# EAGLE design Fartreg 72V (EAGLE 5.03)
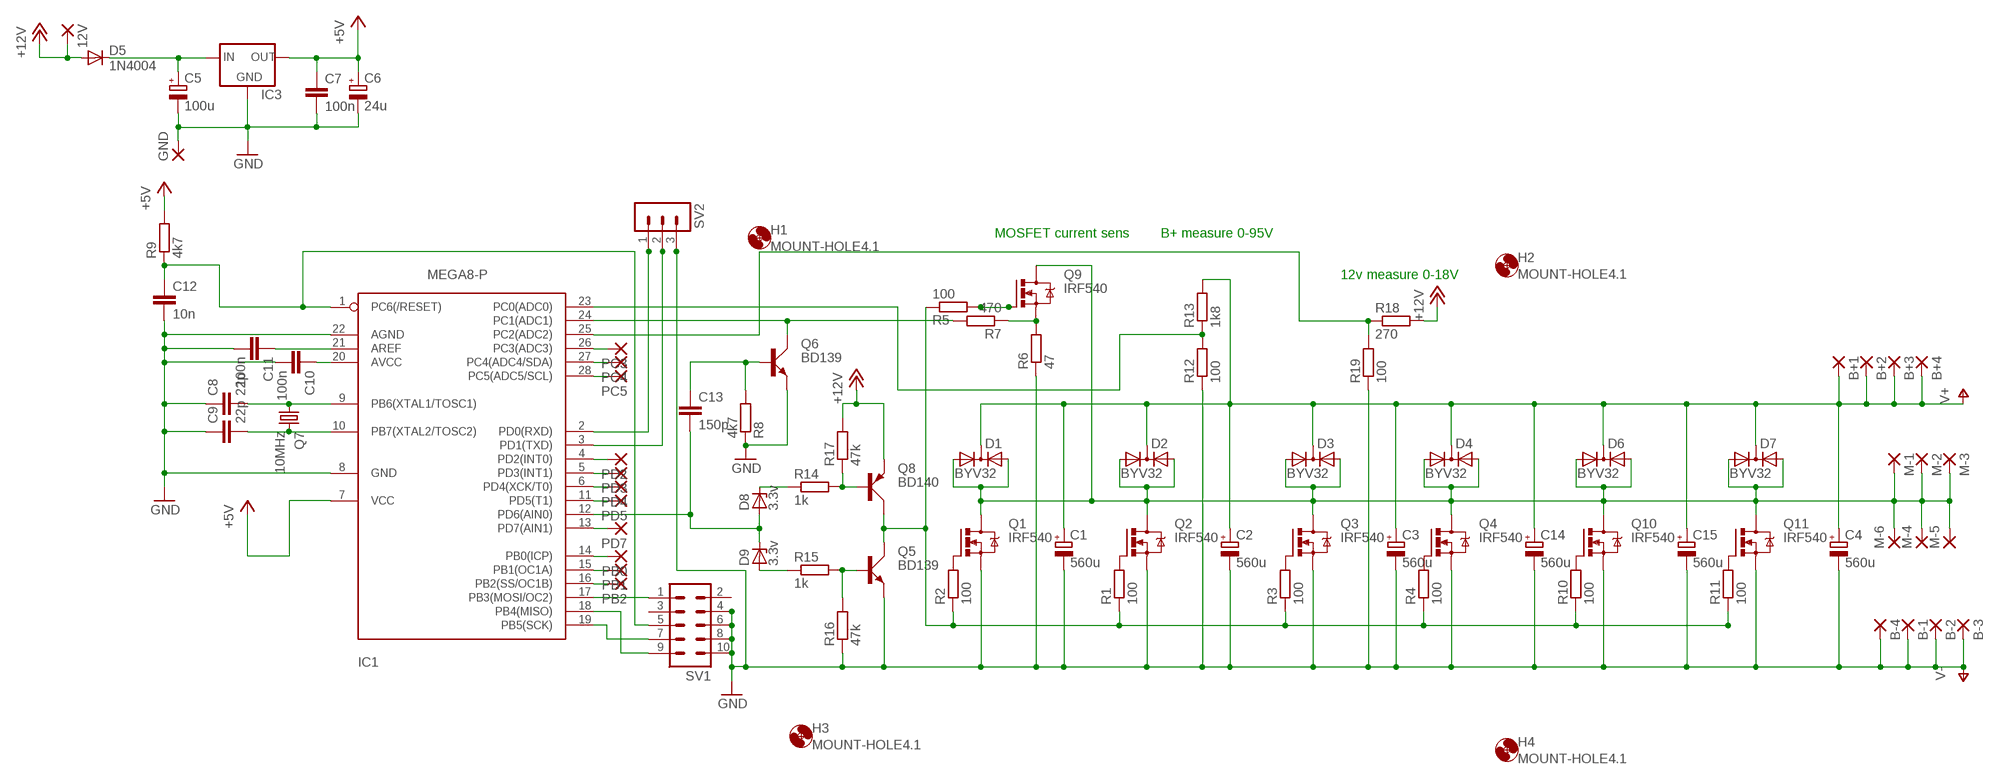
[diagram p0: schematic, sheet 1]

## Parts
12V  3,81/1,4  [3,81/1,4]
B+1  3,81/1,4  [3,81/1,4]
B+2  3,81/1,4  [3,81/1,4]
B+3  3,81/1,4  [3,81/1,4]
B+4  3,81/1,4  [3,81/1,4]
B-1  3,81/1,4  [3,81/1,4]
B-2  3,81/1,4  [3,81/1,4]
B-3  3,81/1,4  [3,81/1,4]
B-4  3,81/1,4  [3,81/1,4]
C1  560u  CPOL-EUE10-22.5  [EB22,5D]
C2  560u  CPOL-EUE10-22.5  [EB22,5D]
C3  560u  CPOL-EUE10-22.5  [EB22,5D]
C4  560u  CPOL-EUE10-22.5  [EB22,5D]
C5  100u  CPOL-EUE2.5-5  [E2,5-5]
C6  24u  CPOL-EUE2.5-5  [E2,5-5]
C7  100n  C-EU025_050-045X075  [C025_050-045X075]
C8  22p  C-EU025_050-045X075  [C025_050-045X075]
C9  22p  C-EU025_050-045X075  [C025_050-045X075]
C10  100n  C-EU025_050-045X075  [C025_050-045X075]
C11  100n  C-EU025_050-045X075  [C025_050-045X075]
C12  10n  C-EU025_050-045X075  [C025_050-045X075]
C13  150p  C-EU025_050-045X075  [C025_050-045X075]
C14  560u  CPOL-EUE10-22.5  [EB22,5D]
C15  560u  CPOL-EUE10-22.5  [EB22,5D]
D1  BYV32  [TO220ABS]
D2  BYV32  [TO220ABS]
D3  BYV32  [TO220ABS]
D4  BYV32  [TO220ABS]
D5  1N4004  [DO41-10]
D6  BYV32  [TO220ABS]
D7  BYV32  [TO220ABS]
D8  3.3v  BZX55  [DO35Z10]
D9  3.3v  BZX55  [DO35Z10]
GND  3,81/1,4  [3,81/1,4]
H1  MOUNT-HOLE4.1  [4,1]
H2  MOUNT-HOLE4.1  [4,1]
H3  MOUNT-HOLE4.1  [4,1]
H4  MOUNT-HOLE4.1  [4,1]
IC1  MEGA8-P  [DIL28-3]
IC3  78XXS  [78XXS]
M-1  3,81/1,4  [3,81/1,4]
M-2  3,81/1,4  [3,81/1,4]
M-3  3,81/1,4  [3,81/1,4]
M-4  3,81/1,4  [3,81/1,4]
M-5  3,81/1,4  [3,81/1,4]
M-6  3,81/1,4  [3,81/1,4]
PB0  1,6/0,9  [1,6/0,9]
PB1  1,6/0,9  [1,6/0,9]
PB2  1,6/0,9  [1,6/0,9]
PC3  1,6/0,9  [1,6/0,9]
PC4  1,6/0,9  [1,6/0,9]
PC5  1,6/0,9  [1,6/0,9]
PD2  1,6/0,9  [1,6/0,9]
PD3  1,6/0,9  [1,6/0,9]
PD4  1,6/0,9  [1,6/0,9]
PD5  1,6/0,9  [1,6/0,9]
PD7  1,6/0,9  [1,6/0,9]
Q1  IRF540  [TO220BV]
Q2  IRF540  [TO220BV]
Q3  IRF540  [TO220BV]
Q4  IRF540  [TO220BV]
Q5  BD139  [TO126AV]
Q6  BD139  [TO126AV]
Q7  10MHz  CRYSTALHC49S  [HC49/S]
Q8  BD140  [TO126AV]
Q9  IRF540  [TO220BV]
Q10  IRF540  [TO220BV]
Q11  IRF540  [TO220BV]
R1  100  R-EU_0207/10  [0207/10]
R2  100  R-EU_0207/10  [0207/10]
R3  100  R-EU_0207/10  [0207/10]
R4  100  R-EU_0207/10  [0207/10]
R5  100  R-EU_0207/10  [0207/10]
R6  47  R-EU_0207/10  [0207/10]
R7  470  R-EU_0207/10  [0207/10]
R8  4k7  R-EU_0207/10  [0207/10]
R9  4k7  R-EU_0207/10  [0207/10]
R10  100  R-EU_0207/10  [0207/10]
R11  100  R-EU_0207/10  [0207/10]
R12  100  R-EU_0207/10  [0207/10]
R13  1k8  R-EU_0207/10  [0207/10]
R14  1k  R-EU_0207/10  [0207/10]
R15  1k  R-EU_0207/10  [0207/10]
R16  47k  R-EU_0207/10  [0207/10]
R17  47k  R-EU_0207/10  [0207/10]
R18  270  R-EU_0207/10  [0207/10]
R19  100  R-EU_0207/10  [0207/10]
SV1  MA05-2  [MA05-2]
SV2  MA03-1  [MA03-1]

## Nets
+5V: C6.+ C7.1 IC1.7(VCC) IC3.OUT R9.2
+12V: 12V.1(P) D5.A Q8.E R17.2 R18.2
GND: B-1.1(P) B-2.1(P) B-3.1(P) B-4.1(P) C1.- C2.- C3.- C4.- C5.- C6.- C7.2 C8.1 C9.1 C10.2 C11.2 C12.2 C14.- C15.- GND.1(P) IC1.8(GND) IC1.22(AGND) IC3.GND Q1.S Q2.S Q3.S Q4.S Q5.E Q6.E Q10.S Q11.S R6.1 R8.1 R12.1 R16.1 R19.1 SV1.4 SV1.6 SV1.8 SV1.10 SV2.3 ; supply symbol labelled V-
N$1: Q10.G R10.2
N$2: IC1.24(PC1(ADC1)) Q6.C R7.2
N$3: Q9.S R6.2 R7.1
N$4: C13.1 Q6.B R8.2
N$5: C10.1 IC1.20(AVCC)
N$6: C11.1 IC1.21(AREF)
N$7: Q2.G R1.2
N$8: Q1.G R2.2
N$9: Q3.G R3.2
N$10: Q4.G R4.2
N$11: IC1.28(PC5(ADC5/SCL)) PC5.1(P)
N$12: C8.2 IC1.9(PB6(XTAL1/TOSC1)) Q7.1
N$13: Q5.C Q8.C R1.1 R2.1 R3.1 R4.1 R5.1 R10.1 R11.1
N$14: C9.2 IC1.10(PB7(XTAL2/TOSC2)) Q7.2
N$15: Q9.G R5.2
N$16: IC1.2(PD0(RXD)) SV2.1
N$17: C5.+ D5.C IC3.IN
N$18: Q11.G R11.2
N$19: IC1.3(PD1(TXD)) SV2.2
N$20: IC1.17(PB3(MOSI/OC2)) SV1.1
N$21: IC1.19(PB5(SCK)) SV1.7
N$22: IC1.18(PB4(MISO)) SV1.9
N$23: D1.A1 D1.A2 D2.A1 D2.A2 D3.A1 D3.A2 D4.A1 D4.A2 D6.A1 D6.A2 D7.A1 D7.A2 M-1.1(P) M-2.1(P) M-3.1(P) M-4.1(P) M-5.1(P) M-6.1(P) Q1.D Q2.D Q3.D Q4.D Q9.D Q10.D Q11.D
N$24: C13.2 D8.A D9.C IC1.12(PD6(AIN0))
N$25: C12.1 IC1.1(PC6(/RESET)) R9.1 SV1.5
N$26: IC1.23(PC0(ADC0)) R12.2 R13.1
N$27: Q8.B R14.2 R17.1
N$28: D9.A R15.1
N$29: D8.C R14.1
N$30: Q5.B R15.2 R16.2
N$31: IC1.25(PC2(ADC2)) R18.1 R19.2
N$32: IC1.11(PD5(T1)) PD5.1(P)
N$33: IC1.26(PC3(ADC3)) PC3.1(P)
N$34: IC1.27(PC4(ADC4/SDA)) PC4.1(P)
N$36: IC1.4(PD2(INT0)) PD2.1(P)
N$37: IC1.5(PD3(INT1)) PD3.1(P)
N$38: IC1.6(PD4(XCK/T0)) PD4.1(P)
N$40: IC1.13(PD7(AIN1)) PD7.1(P)
N$41: IC1.14(PB0(ICP)) PB0.1(P)
N$42: IC1.15(PB1(OC1A)) PB1.1(P)
N$43: IC1.16(PB2(SS/OC1B)) PB2.1(P)
V+: B+1.1(P) B+2.1(P) B+3.1(P) B+4.1(P) C1.+ C2.+ C3.+ C4.+ C14.+ C15.+ D1.C D2.C D3.C D4.C D6.C D7.C R13.2
Unconnected: SV1.2 SV1.3

## Notes on the sheet
- MOSFET current sens | B+ measure 0-95V
- 12v measure 0-18V

## Library data of the parts
12V B+1-B+4 B-1-B-4 GND M-1-M-6 = wirepad:3,81/1,4: THROUGH-HOLE PAD
C1-C6 C14 C15 = rcl:CPOL-EU: POLARIZED CAPACITOR, European symbol
C7-C13 = rcl:C-EU: CAPACITOR, European symbol
D1-D4 D6 D7 = diode:BYV32: DIODE 2 x Si diode 200 V, 20 A/230 Apeak, 25 ns
D5 = diode:1N4004: DIODE general purpose rectifier, 1 A
D8 D9 = diode:BZX55: Z DIODE
H1-H4 = holes:MOUNT-HOLE: MOUNTING HOLE with drill center marker
IC1 = atmel:MEGA8-P: MICROCONTROLLER 8 Kbytes FLASH 1 kbytes SRAM 512 bytes EEPROM USART 4-channel 10 bit ADC 2-channel 8 bit ADC Source: avr.lbr
IC3 = v-reg:78XXS: VOLTAGE REGULATOR
PB0 PB1 PB2 PC3-PC5 PD2-PD5 PD7 = wirepad:1,6/0,9: THROUGH-HOLE PAD
Q1-Q4 Q9-Q11 = transistor-power:IRF540: HEXFET Power MOSFET
Q5 Q6 = transistor-power:BD139: NPN TRANSISTOR
Q7 = crystal:CRYSTAL: CRYSTAL
Q8 = transistor-power:BD140: PNP TRANSISTOR
R1-R19 = rcl:R-EU_: RESISTOR, European symbol
SV1 = con-lstb:MA05-2: PIN HEADER
SV2 = con-lstb:MA03-1: PIN HEADER

## Board
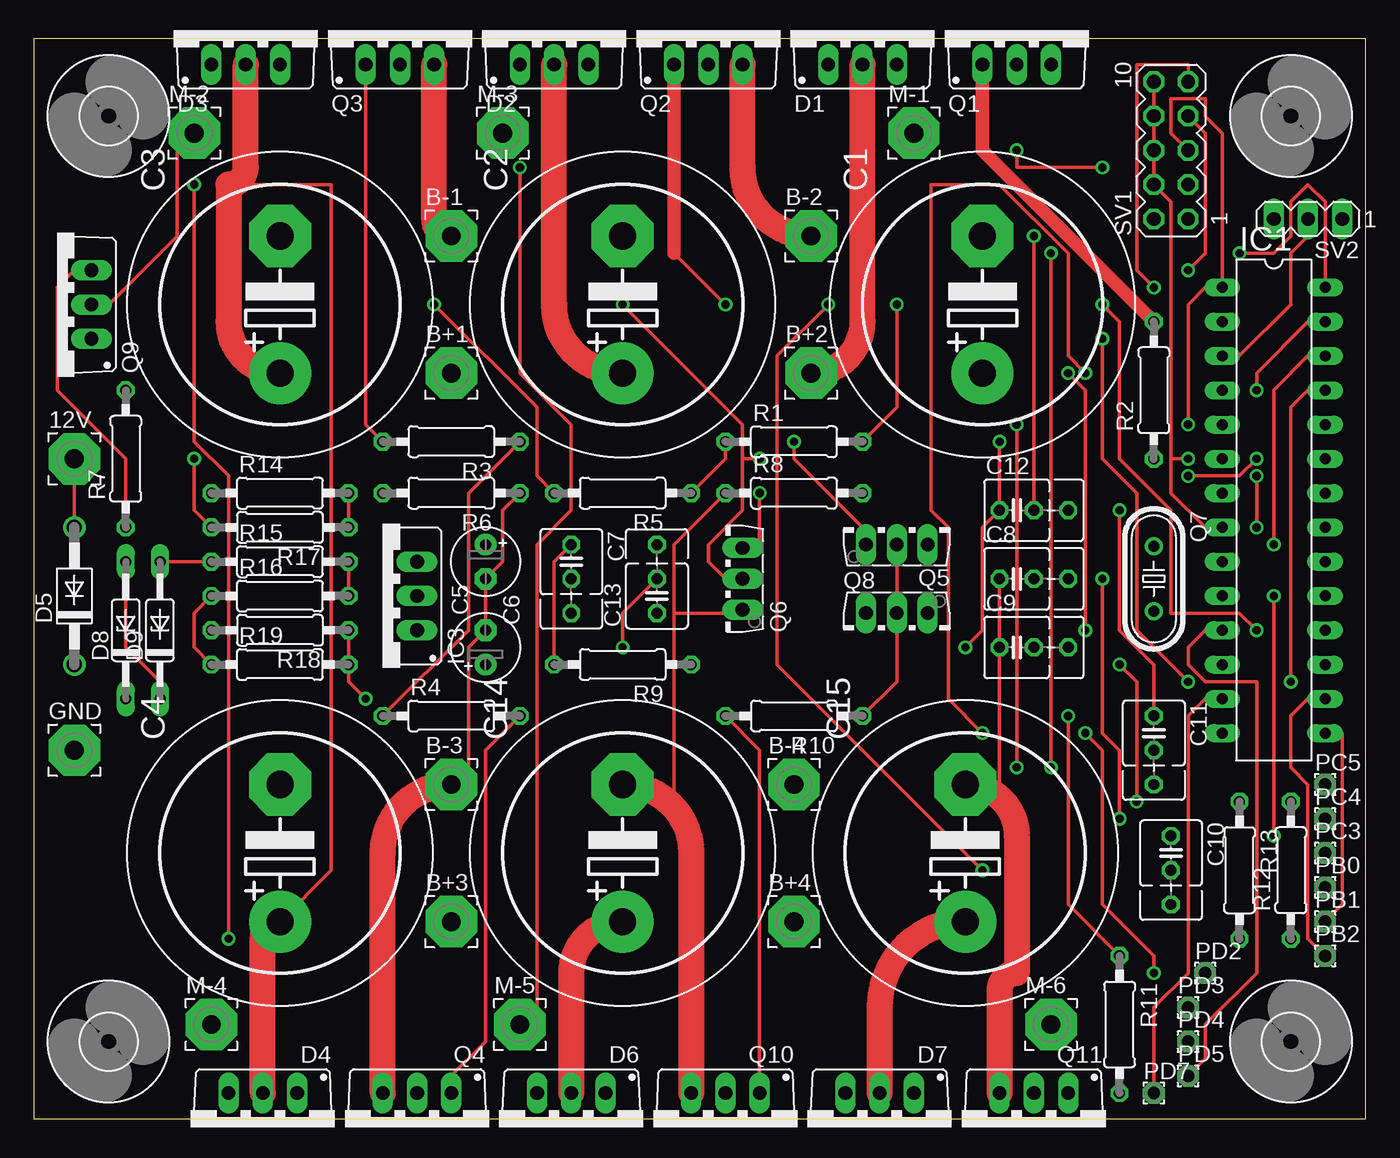
[diagram p1: board, top side]
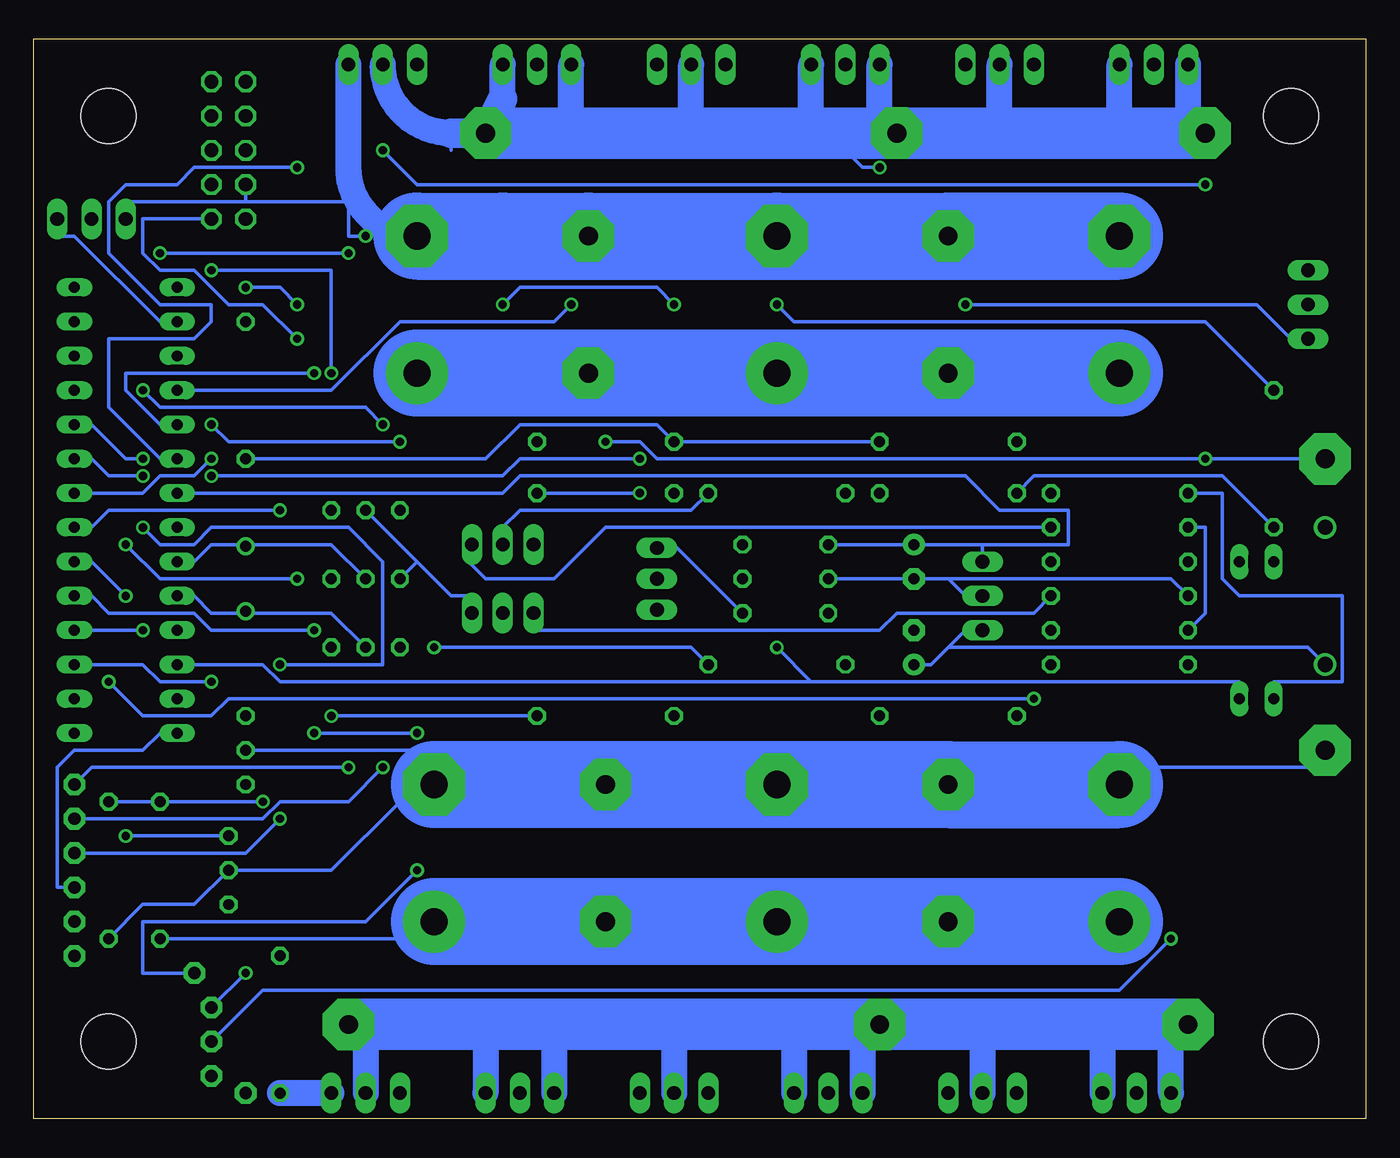
[diagram p2: board, bottom side, seen from below]

Size 98.73 x 80 mm. Coordinates in mm from the lower left corner, seen from the top.
Outline: 0,0 98.73,0 98.73,80 0,80 0,0
Copper layers (1*16): Top 0.035mm / dielectric 1.5mm / Bottom 0.035mm
Design rules "default": minimum track width 10mil, minimum drill 24mil, track to track 8mil, track to pad 8mil, pad to pad 8mil, via to via 8mil, smd to smd 8mil, copper to edge 40mil, drill to drill 8mil, minimum pad ring 10mil, minimum via ring 8mil, stop-mask expansion 4mil, vias tented up to drill 0mil, thermal gap 10mil

### Footprints (pad centres in the part's own frame; a part is rotated, then mirrored left to right if it is on the bottom)
3,81/1,4 = drill 1.397 pad 3.81 octagon: 1 0,0
EB22,5D = drill 2.007 pad 4.597 round: + -5.08,0 | drill 2.007 pad 4.597 octagon: - 5.08,0
E2,5-5 = drill 0.813 pad 1.6 round: + -1.27,0 | drill 0.813 pad 1.6 octagon: - 1.27,0
C025_050-045X075 = drill 0.813 octagon: 1 -1.27,0; 2 1.27,0; 3 3.81,0
TO220ABS = drill 1.016 long: A1 -2.54,-2.54; A2 2.54,-2.54; C 0,-2.54
DO41-10 = drill 1.118 round: A 5.08,0; C -5.08,0
DO35Z10 = drill 0.813 long: A 5.08,0; C -5.08,0
4,1 = hole 4.1: 0,0
DIL28-3 = drill 0.813 long: 1 -16.51,-3.81; 2 -13.97,-3.81; 3 -11.43,-3.81; 4 -8.89,-3.81; 5 -6.35,-3.81; 6 -3.81,-3.81; 7 -1.27,-3.81; 8 1.27,-3.81; 9 3.81,-3.81; 10 6.35,-3.81; 11 8.89,-3.81; 12 11.43,-3.81; 13 13.97,-3.81; 14 16.51,-3.81; 15 16.51,3.81; 16 13.97,3.81; 17 11.43,3.81; 18 8.89,3.81; 19 6.35,3.81; 20 3.81,3.81; 21 1.27,3.81; 22 -1.27,3.81; 23 -3.81,3.81; 24 -6.35,3.81; 25 -8.89,3.81; 26 -11.43,3.81; 27 -13.97,3.81; 28 -16.51,3.81
78XXS = drill 1.016 long: GND 0,-2.54; IN -2.54,-2.54; OUT 2.54,-2.54
1,6/0,9 = drill 0.914 pad 1.6 octagon: 1 0,0
TO220BV = drill 1.016 long: D 0,-2.54; G -2.54,-2.54; S 2.54,-2.54
TO126AV = drill 1.016 long: B 2.286,-1.27; C 0,-1.27; E -2.286,-1.27
HC49/S = drill 0.813 round: 1 -2.413,0; 2 2.413,0
0207/10 = drill 0.813 octagon: 1 -5.08,0; 2 5.08,0
MA05-2 = drill 1.016 octagon: 1 -5.08,-1.27; 2 -5.08,1.27; 3 -2.54,-1.27; 4 -2.54,1.27; 5 0,-1.27; 6 0,1.27; 7 2.54,-1.27; 8 2.54,1.27; 9 5.08,-1.27; 10 5.08,1.27
MA03-1 = drill 1.016 long: 1 -2.54,0; 2 0,0; 3 2.54,0

### Placement (x,y rotation side)
12V  3.01,48.89 0 top
B+1  30.95,55.24 0 top
B+2  57.62,55.24 0 top
B+3  30.95,14.6 0 top
B+4  56.35,14.6 0 top
B-1  30.95,65.4 0 top
B-2  57.62,65.4 0 top
B-3  30.95,24.76 0 top
B-4  56.35,24.76 0 top
C1  70.32,60.32 90 top
C2  43.65,60.32 90 top
C3  18.25,60.32 90 top
C4  18.25,19.68 90 top
C5  33.49,34.92 90 top
C6  33.49,41.27 270 top
C7  39.84,41.27 270 top
C8  72.86,40 0 top
C9  72.86,34.92 0 top
C10  84.29,19.68 270 top
C11  83.02,28.57 270 top
C12  72.86,45.08 0 top
C13  46.19,38.73 90 top
C14  43.65,19.68 90 top
C15  69.05,19.68 90 top
D1  61.43,80.64 0 top
D2  38.57,80.64 0 top
D3  15.71,80.64 0 top
D4  16.98,-0.64 180 top
D5  3.01,38.73 90 top
D6  39.84,-0.64 180 top
D7  62.7,-0.64 180 top
D8  6.82,36.19 90 top
D9  9.36,36.19 90 top
GND  3.01,27.3 0 top
H1  5.55,5.71 0 top
H2  5.55,74.29 0 top
H3  93.18,74.29 0 top
H4  93.18,5.71 0 top
IC1  91.91,45.08 270 top
IC3  25.87,38.73 90 top
M-1  65.24,73.02 0 top
M-2  11.9,73.02 0 top
M-3  34.76,73.02 0 top
M-4  13.17,6.98 0 top
M-5  36.03,6.98 0 top
M-6  75.4,6.98 0 top
PB0  95.72,17.14 0 top
PB1  95.72,14.6 0 top
PB2  95.72,12.06 0 top
PC3  95.72,19.68 0 top
PC4  95.72,22.22 0 top
PC5  95.72,24.76 0 top
PD2  86.83,10.79 0 top
PD3  85.56,8.25 0 top
PD4  85.56,5.71 0 top
PD5  85.56,3.17 0 top
PD7  83.02,1.9 0 top
Q1  72.86,80.64 0 top
Q2  50,80.64 0 top
Q3  27.14,80.64 0 top
Q4  28.41,-0.64 180 top
Q5  63.97,36.19 180 top
Q6  51.27,40 90 top
Q7  83.02,40 270 top
Q8  63.97,43.81 0 top
Q9  1.74,60.32 90 top
Q10  51.27,-0.64 180 top
Q11  74.13,-0.64 180 top
R1  56.35,50.16 0 top
R2  83.02,53.97 90 top
R3  30.95,50.16 180 top
R4  30.95,29.84 0 top
R5  43.65,46.35 180 top
R6  30.95,46.35 180 top
R7  6.82,48.89 90 top
R8  56.35,46.35 0 top
R9  43.65,33.65 180 top
R10  56.35,29.84 180 top
R11  80.48,6.98 270 top
R12  93.18,18.41 90 top
R13  89.37,18.41 270 top
R14  18.25,46.35 0 top
R15  18.25,41.27 0 top
R16  18.25,38.73 0 top
R17  18.25,43.81 180 top
R18  18.25,36.19 180 top
R19  18.25,33.65 0 top
SV1  84.29,71.75 90 top
SV2  94.45,66.67 180 top

### Tracks (layer width: path | path; a pad name or v marks a point on that pad's centre or on a via)
+5V
  Top 0.254: R9.2 38.57,41.27 C7.1
  Bottom 0.254: 28.41,42.54 C6.+ C7.1 | 28.41,42.54 22.06,42.54 22.06,45.08 27.14,45.08 29.68,47.62 62.7,47.62 63.97,46.35 IC1.7 | 28.41,42.54 IC3.OUT
+12V  (via drill 0.61)
  Top 0.254: v56.35,50.16 56.35,48.89 61.43,43.81 Q8.E | D5.A 12V.1 | R17.2 11.9,45.08 v11.9,48.89
  Bottom 0.254: R18.2 11.9,37.46 11.9,43.81 R17.2 | v56.35,50.16 53.81,50.16 52.54,48.89 v11.9,48.89 12V.1
GND  (via drill 0.61)
  Top 0.254: C15.- 67.78,26.03 | SV1.10 SV1.8 SV1.6 SV1.4 84.29,67.94 84.29,48.89 | 84.29,48.89 84.29,46.35 86.83,43.81 IC1.8 | 84.29,48.89 v85.56,48.89 | R19.1 11.9,34.92 11.9,37.46 R16.1 | R6.1 34.76,45.08 34.76,41.27 C6.- C5.- 32.22,34.92 32.22,26.03 B-3.1 | C8.1 C9.1 71.59,24.76 71.16,24.12 | R8.1 47.46,42.54 47.46,37.46 | 47.46,37.46 47.46,23.49 47.24,23.27 | 47.46,37.46 51.27,37.46 Q6.E | C12.2 v74.13,65.4
  Top 1.93: Q3.S 29.68,66.67 arc90 B-1.1 | Q2.S 52.54,70.48 arc90 B-2.1 | Q10.S 48.73,19.68 arc45 47.24,23.27 arc45 C14.- | Q11.S 71.59,9.52 arc-90 72.86,10.79 72.86,20.95 arc56 71.16,24.12 arc34 C15.- | Q4.S 25.87,19.68 arc-90 B-3.1
  Bottom 0.254: C15.- 71.59,26.03 | 63.97,65.4 63.97,62.86 | C4.- 15.71,26.03 4.28,26.03 GND.1 | 75.4,67.94 83.02,67.94 | 83.02,67.94 91.91,67.94 SV2.3 | v85.56,48.89 86.83,47.62 89.37,47.62 90.64,46.35 IC1.22 | 83.02,67.94 SV1.4 | C7.2 C6.- 30.95,40 | 30.95,40 29.68,38.73 IC3.GND | R16.1 14.44,40 30.95,40 | 70.32,41.27 67.78,38.73 66.51,38.73 Q5.E | 70.32,41.27 C12.2 | C8.1 70.32,41.27 | R12.1 90.64,15.87 86.83,15.87 C10.2 76.67,18.41 71.59,23.49 C15.- | C11.2 70.32,27.3 C15.- | 75.4,67.94 75.4,65.4 v74.13,65.4 | 75.4,67.94 74.86,68.21
  Bottom 1.93: Q1.S 75.4,70.48 arc-27 74.86,68.21 arc-63 C1.-
  Bottom 6.452: B-1.1 C3.- C2.- B-2.1 63.97,65.4 C1.- | C4.- B-3.1 C14.- B-4.1 C15.-
N$1
  Top 0.254: R10.2 53.81,27.3 Q10.G
N$2  (via drill 0.61)
  Top 0.254: v43.65,60.32 52.54,51.43 52.54,48.89 | 52.54,48.89 52.54,45.08 50,42.54 50,41.27 51.27,40 Q6.C | v90.64,48.89 89.37,47.62 v85.56,47.62 | 52.54,48.89 v53.81,48.89
  Bottom 0.254: R7.2 11.9,59.05 42.38,59.05 v43.65,60.32 | v90.64,48.89 91.91,48.89 94.45,51.43 IC1.24 | v85.56,47.62 63.97,47.62 62.7,48.89 v53.81,48.89
N$3
  Top 0.254: R7.1 6.82,48.89 1.74,53.97 1.74,61.59 3.01,62.86 Q9.S
  Bottom 0.254: R7.1 10.63,47.62 24.6,47.62 R6.2
N$4  (via drill 0.61)
  Top 0.254: v53.81,46.35 53.81,42.54 Q6.B
  Bottom 0.254: C13.1 51.27,42.54 Q6.B | v53.81,46.35 R8.2
N$5  (via drill 0.61)
  Top 0.254: v91.91,20.95 v91.91,38.73
  Bottom 0.254: C10.1 v91.91,20.95 | v91.91,38.73 94.45,41.27 IC1.20
N$6  (via drill 0.61)
  Top 0.254: C11.1 83.02,33.65 80.48,36.19 v80.48,45.08
  Bottom 0.254: v80.48,45.08 93.18,45.08 94.45,43.81 IC1.21
N$7  (via drill 0.61)
  Top 0.254: R1.2 63.97,52.7 v63.97,60.32 | v51.27,60.32 47.46,64.13
  Top 1.016: 47.46,64.13 Q2.G
  Bottom 0.254: v63.97,60.32 62.7,61.59 52.54,61.59 v51.27,60.32
N$8
  Top 1.016: Q1.G 70.32,71.75 R2.2
N$9
  Top 0.254: R3.2 24.6,51.43 Q3.G
N$10
  Top 0.254: R4.2 33.49,27.3 33.49,5.71 30.95,3.17 Q4.G
N$11  (via drill 0.61)
  Top 0.254: IC1.28 95.72,67.94 94.45,69.21 93.18,67.94 93.18,65.4 91.91,64.13 v89.37,64.13 | v75.4,26.03 v75.4,64.13
  Bottom 0.254: v75.4,64.13 v89.37,64.13 | v75.4,26.03 94.45,26.03 PC5.1
N$12
  Bottom 0.254: C8.2 76.67,42.54 83.02,42.54 | 83.02,42.54 85.56,42.54 86.83,41.27 IC1.9 | 83.02,42.54 Q7.1
N$13  (via drill 0.61)
  Top 0.254: R10.1 63.97,32.38 Q5.C Q8.C | R11.1 76.67,15.87 v76.67,29.84 | R4.1 32.22,36.19 32.22,46.35 R3.1 | R5.1 51.27,48.89 R1.1
  Bottom 0.254: R10.1 v76.67,29.84 | R2.1 65.24,48.89 62.7,51.43 52.54,51.43 R1.1 R3.1 | R5.1 50,45.08 62.7,45.08 63.97,43.81 Q8.C
N$14
  Bottom 0.254: C9.2 76.67,37.46 83.02,37.46 | 83.02,37.46 85.56,37.46 86.83,38.73 IC1.10 | 83.02,37.46 Q7.2
N$15  (via drill 0.61)
  Top 0.254: R5.2 37.3,47.62 37.3,52.7 v29.68,60.32
  Bottom 0.254: v29.68,60.32 8.09,60.32 5.55,57.78 Q9.G
N$16
  Bottom 0.254: IC1.2 89.37,59.05 95.72,65.4 96.99,65.4 SV2.1
N$17
  Bottom 0.254: 30.95,34.92 32.22,33.65 C5.+ | 30.95,34.92 29.68,36.19 IC3.IN | D5.C 4.28,34.92 30.95,34.92
N$18
  Bottom 1.93: Q11.G R11.2
N$19
  Top 0.254: IC1.3 89.37,56.51 93.18,60.32 93.18,64.13 94.45,65.4 SV2.2
N$20  (via drill 0.61)
  Top 0.254: v85.56,32.38 81.75,36.19 81.75,46.35 79.21,48.89 v79.21,57.78
  Bottom 0.254: v85.56,32.38 89.37,32.38 90.64,33.65 IC1.17 | v79.21,57.78 81.75,60.32 84.29,60.32 86.83,62.86 89.37,62.86 90.64,64.13 90.64,66.67 SV1.1
N$21  (via drill 0.61)
  Top 0.254: v77.94,36.19 77.94,53.97 v76.67,55.24 | v85.56,62.86 86.83,64.13 86.83,73.02 SV1.7
  Bottom 0.254: v77.94,36.19 85.56,36.19 86.83,37.46 93.18,37.46 94.45,38.73 IC1.19 | v76.67,55.24 76.67,62.86 v85.56,62.86
N$22  (via drill 0.61)
  Top 0.254: v90.64,36.19 89.37,37.46 84.29,37.46 84.29,45.08 80.48,48.89 80.48,59.05 v79.21,60.32 | v83.02,61.59 81.75,62.86 81.75,78.1 85.56,78.1 SV1.9
  Bottom 0.254: v79.21,60.32 80.48,61.59 v83.02,61.59 | v90.64,36.19 IC1.18
N$23  (via drill 0.61)
  Top 0.254: Q9.D 5.55,60.32 10.63,65.4 10.63,71.75 M-2.1 | v36.03,70.48 36.03,55.24 39.84,51.43 39.84,45.08 37.3,42.54 37.3,8.25 M-5.1
  Bottom 0.254: 67.78,73.02 67.78,71.75 | 39.84,73.02 39.84,71.75 | v36.03,70.48 37.3,70.48 38.57,71.75 38.57,73.02
  Bottom 1.93: 18.25,73.02 D3.A2 | 13.17,73.02 D3.A1 | 27.14,73.02 Q3.D | 36.03,73.02 D2.A1 | 41.11,73.02 D2.A2 | 50,73.02 Q2.D | 58.89,73.02 D1.A1 | 63.97,73.02 D1.A2 | 67.78,73.02 arc90 Q1.D | D4.A2 14.44,6.98 | 19.52,6.98 D4.A1 | 42.38,6.98 D6.A1 | 65.24,6.98 D7.A1 | 60.16,6.98 D7.A2 | 51.27,6.98 Q10.D | 74.13,6.98 Q11.D | 28.41,6.98 Q4.D | 37.3,6.98 D6.A2
  Bottom 2.184: 63.97,75.56 M-1.1 67.78,73.02 | 65.24,5.71 63.97,6.98 65.24,6.98 | 74.13,6.98 69.05,6.98
  Bottom 3.81: M-2.1 13.17,73.02 18.25,73.02 27.14,73.02 M-3.1 36.03,73.02 38.57,73.02 39.84,73.02 41.11,73.02 50,73.02 58.89,73.02 63.97,73.02 M-1.1 | M-4.1 14.44,6.98 19.52,6.98 28.41,6.98 M-5.1 37.3,6.98 42.38,6.98 51.27,6.98 60.16,6.98 65.24,6.98 74.13,6.98 M-6.1
N$24  (via drill 0.61)
  Top 0.254: D9.C 9.36,32.38 6.82,34.92 D8.A | C13.2 43.65,37.46 v43.65,34.92
  Bottom 0.254: 41.11,32.38 v43.65,34.92 | 41.11,32.38 9.36,32.38 D9.C | 41.11,32.38 80.48,32.38 81.75,33.65 IC1.12
N$25  (via drill 0.61)
  Top 0.254: SV1.5 84.29,73.02 84.29,75.56 86.83,75.56 86.83,74.29 88.1,73.02 IC1.1 86.83,61.59 85.56,60.32 v85.56,51.43 | v69.05,34.92 70.32,36.19 70.32,43.81 C12.1 v71.59,50.16
  Bottom 0.254: R9.1 50,34.92 v69.05,34.92 | v85.56,51.43 84.29,50.16 v71.59,50.16
N$26  (via drill 0.61)
  Top 0.254: v90.64,43.81 v90.64,47.62 | v80.48,33.65 81.75,32.38 v81.75,23.49
  Bottom 0.254: R12.2 R13.1 v81.75,23.49 | v90.64,47.62 93.18,47.62 94.45,48.89 IC1.23 | v90.64,43.81 89.37,42.54 86.83,42.54 85.56,43.81 75.4,43.81 72.86,41.27 72.86,33.65 v80.48,33.65
N$27
  Top 0.254: R17.1 R14.2
  Bottom 0.254: R17.1 56.35,43.81 60.16,40 65.24,40 66.51,41.27 Q8.B
N$28
  Top 0.254: D9.A R15.1
N$29
  Bottom 0.254: R14.1 10.63,46.35 10.63,40 9.36,38.73 1.74,38.73 1.74,32.38 6.82,32.38 D8.C
N$30
  Top 0.254: R16.2 R15.2
  Bottom 0.254: R16.2 24.6,37.46 34.76,37.46 36.03,36.19 61.43,36.19 Q5.B
N$31  (via drill 0.61)
  Top 0.254: R18.1 R19.2 23.33,32.38 v24.6,31.11 | v93.18,32.38 93.18,52.7 94.45,53.97 IC1.25
  Bottom 0.254: v93.18,32.38 90.64,29.84 85.56,29.84 84.29,31.11 v24.6,31.11
N$32
  Top 0.254: PD5.1 86.83,4.44 86.83,6.98 90.64,10.79 90.64,32.38 86.83,32.38 85.56,33.65 85.56,34.92 86.83,36.19 IC1.11
N$33  (via drill 0.61)
  Top 0.254: v91.91,42.54 91.91,53.97 94.45,56.51 IC1.26 | v79.21,40 79.21,28.57 80.48,27.3 v80.48,22.22
  Bottom 0.254: v91.91,42.54 89.37,40 v79.21,40 | v80.48,22.22 83.02,19.68 PC3.1
N$34  (via drill 0.61)
  Top 0.254: v90.64,53.97 90.64,55.24 94.45,59.05 IC1.27 | v72.86,26.03 v72.86,51.43
  Bottom 0.254: v90.64,53.97 89.37,52.7 74.13,52.7 v72.86,51.43 | v72.86,26.03 75.4,23.49 80.48,23.49 81.75,22.22 PC4.1
N$36  (via drill 0.61)
  Top 0.254: v58.89,60.32 55.08,56.51 55.08,33.65 v70.32,18.41
  Bottom 0.254: v58.89,60.32 60.16,59.05 71.59,59.05 76.67,53.97 IC1.4 | v70.32,18.41 74.13,14.6 90.64,14.6 90.64,10.79 PD2.1
N$37  (via drill 0.61)
  Top 0.254: v77.94,55.24 76.67,56.51 76.67,64.13 71.59,69.21 66.51,69.21 66.51,45.08 67.78,43.81 67.78,31.11 v70.32,28.57 | v77.94,28.57 79.21,27.3 79.21,15.87 83.02,12.06 v83.02,10.79
  Bottom 0.254: v77.94,55.24 91.91,55.24 91.91,53.97 89.37,51.43 IC1.5 | v77.94,28.57 v70.32,28.57 | PD3.1 v83.02,10.79
N$38  (via drill 0.61)
  Top 0.254: v79.21,70.48 72.86,70.48 v72.86,71.75 | v11.9,69.21 11.9,50.16 14.44,47.62 v14.44,13.33
  Bottom 0.254: v79.21,70.48 86.83,70.48 88.1,69.21 91.91,69.21 93.18,67.94 93.18,64.13 89.37,60.32 85.56,60.32 85.56,59.05 86.83,57.78 93.18,57.78 93.18,52.7 89.37,48.89 IC1.6 | v72.86,71.75 70.32,69.21 v11.9,69.21 | v14.44,13.33 18.25,9.52 81.75,9.52 PD4.1
N$40
  Top 0.254: PD7.1 83.02,8.25 85.56,10.79 85.56,29.84 86.83,31.11 IC1.13
N$41
  Bottom 0.254: PB0.1 96.99,17.14 96.99,26.03 95.72,27.3 90.64,27.3 89.37,28.57 IC1.14
N$42
  Top 0.254: PB1.1 96.99,15.87 96.99,28.57 IC1.15
N$43
  Top 0.254: PB2.1 94.45,13.33 94.45,24.76 93.18,26.03 93.18,29.84 94.45,31.11 IC1.16
V+
  Top 0.254: C2.+ 42.38,53.97 | C3.+ 19.52,53.97 | 15.34,69.58 15.71,69.21 22.06,69.21 22.06,18.41 C4.+
  Top 1.93: D6.C 39.84,10.79 arc-90 C14.+ | D4.C 16.98,13.33 arc-90 C4.+ | D2.C 38.57,60.32 arc90 C2.+ | D1.C 61.43,59.05 arc-90 B+2.1 | D3.C 15.71,70.48 arc-45 15.34,69.58 arc-45 14.44,69.21 14.44,59.05 arc90 C3.+ | D7.C 62.7,8.25 arc-90 C15.+
  Bottom 0.254: R13.2 71.59,13.33 C15.+ | 41.11,14.6 41.11,17.14
  Bottom 6.452: B+1.1 C3.+ C2.+ B+2.1 C1.+ | C4.+ B+3.1 41.11,14.6 C14.+ B+4.1 C15.+